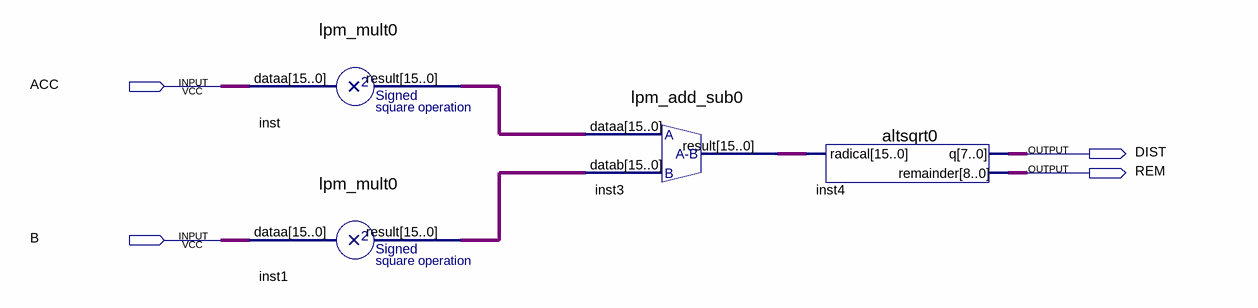
[diagram p0: schematic sheet]
// Quartus schematic Dist.bdf as structural Verilog: 4 symbols, 4 pins
module Dist (
  input  ACC,
  input  B,
  output DIST,
  output REM
);

  wire [7:0] inst4_q;
  wire [8:0] inst4_remainder;
  wire [15:0] inst1_result, inst3_result, inst_result, undriven, undriven_2;

  lpm_mult0 inst (.dataa(undriven), .result(inst_result));
  lpm_mult0 inst1 (.dataa(undriven_2), .result(inst1_result));
  lpm_add_sub0 inst3 (.dataa(inst_result), .datab(inst1_result), .result(inst3_result));
  altsqrt0 inst4 (.radical(inst3_result), .q(inst4_q), .remainder(inst4_remainder));
endmodule
